# Altium project LED_EN_Kian_V2.PrjPcb
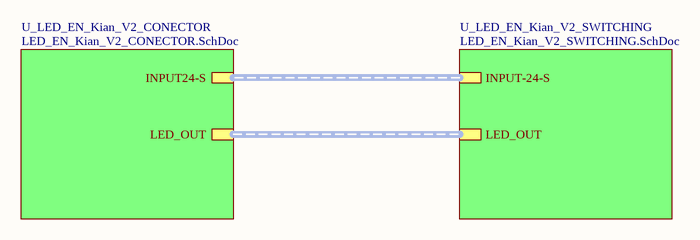
[diagram p0: LED_EN_Kian_V2_MANAGE.SchDoc]
3 sheets, 37 parts. Net scope: hierarchical (ports join the sheet entries above them; power ports are global).
Board file: LED_EN_Kian_V2_troid.PcbDoc
Sheets:
  LED_EN_Kian_V2_MANAGE.SchDoc
    U_LED_EN_Kian_V2_CONECTOR = LED_EN_Kian_V2_CONECTOR.SchDoc
    U_LED_EN_Kian_V2_SWITCHING = LED_EN_Kian_V2_SWITCHING.SchDoc

## Sheet LED_EN_Kian_V2_MANAGE.SchDoc
size A

### Sub-sheets
U_LED_EN_Kian_V2_CONECTOR = LED_EN_Kian_V2_CONECTOR.SchDoc: LED_OUT (harness LED_OUT), INPUT24-S (harness INPUT-24-S)
U_LED_EN_Kian_V2_SWITCHING = LED_EN_Kian_V2_SWITCHING.SchDoc: INPUT-24-S (harness INPUT-24-S), LED_OUT (harness LED_OUT)

### Buses and harness runs
harness sheet U_LED_EN_Kian_V2_CONECTOR/INPUT24-S = sheet U_LED_EN_Kian_V2_SWITCHING/INPUT-24-S
harness sheet U_LED_EN_Kian_V2_CONECTOR/LED_OUT = sheet U_LED_EN_Kian_V2_SWITCHING/LED_OUT

## Sheet LED_EN_Kian_V2_CONECTOR.SchDoc
size A
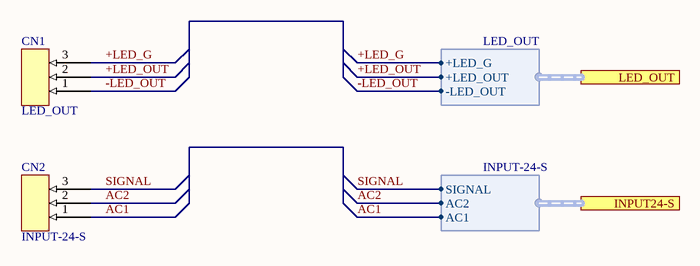
[diagram p1: LED_EN_Kian_V2_CONECTOR.SchDoc]

### Parts
CN1  LED_OUT  [CONECTOR/FONIX/3PIN]
CN2  INPUT-24-S  [CONECTOR/FONIX/3PIN]

### Ports
INPUT24-S (harness INPUT-24-S), LED_OUT (harness LED_OUT)

### Harnesses
LED_OUT: +LED_G, +LED_OUT, -LED_OUT
INPUT-24-S: SIGNAL, AC2, AC1

### Nets
+LED_G: CN1.3 ; port LED_OUT.+LED_G
+LED_OUT: CN1.2 ; port LED_OUT.+LED_OUT
-LED_OUT: CN1.1 ; port LED_OUT.-LED_OUT
AC1: CN2.1 ; port INPUT24-S.AC1
AC2: CN2.2 ; port INPUT24-S.AC2
SIGNAL: CN2.3 ; port INPUT24-S.SIGNAL

### Library data of the parts
CN1 CN2 = CONECTOR/FONIX/3PIN

## Sheet LED_EN_Kian_V2_SWITCHING.SchDoc
size 260 x 299 mm
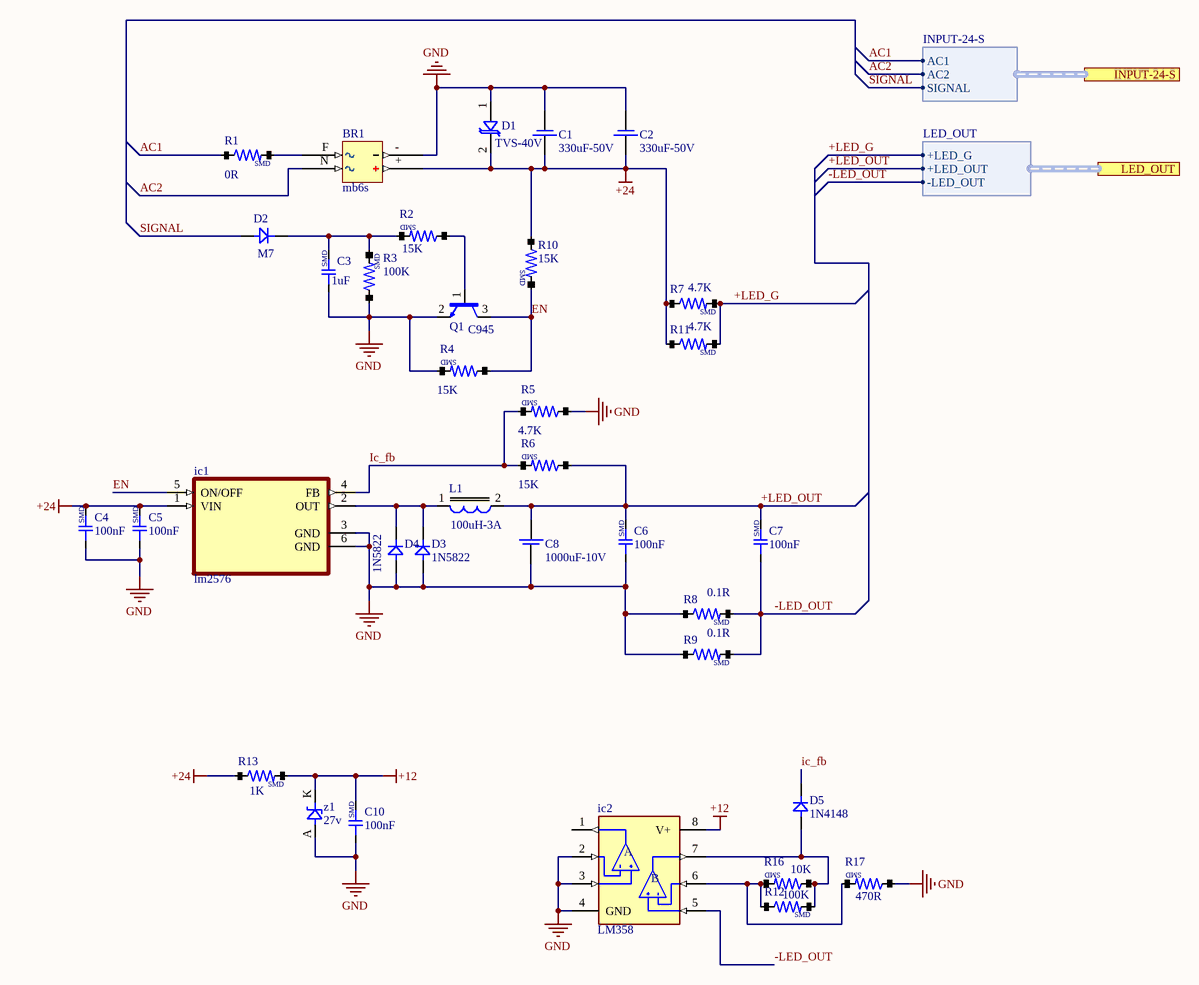
[diagram p2: LED_EN_Kian_V2_SWITCHING.SchDoc]

### Parts
BR1  mb6s  [MB6S/SMD]
C1  330uF-50V  [CAP-EL_P5MM]
C2  330uF-50V  [CAP-EL_P5MM]
C3  1uF  [CAP-0805]
C4  100nF  [CAP-0805]
C5  100nF  [CAP-0805]
C6  100nF  [CAP-0805]
C7  100nF  [CAP-0805]
C8  1000uF-10V  [CAP-EL-P3.5MM]
C10  100nF  [CAP-0805]
D1  TVS-40V  [TVS-5V-SMD]
D2  M7  [DIOD/1N4007/SMD]
D3  1N5822  [DIOD/1N4007/SMD]
D4  1N5822  [DIOD/1N4007/DIP]
D5  1N4148  [mini_melf]
ic1  lm2576  [lm2576]
ic2  LM358  [SOP-8]
L1  100uH-3A  [inductor-9*12]
Q1  C945  [SOT23]
R1  0R  [RES/1206]
R2  15K  [RES/0805]
R3  100K  [RES/0805]
R4  15K  [RES/0805]
R5  4.7K  [RES/0805]
R6  15K  [RES/0805]
R7  4.7K  [RES/1206]
R8  0.1R  [RES/1206]
R9  0.1R  [RES/1206]
R10  15K  [RES/0805]
R11  4.7K  [RES/1206]
R12  100K  [RES/0805]
R13  1K  [RES/1206]
R16  10K  [RES/0805]
R17  470R  [RES/0805]
z1  27v  [DIOD/RS1J]

### Ports
INPUT-24-S (harness INPUT-24-S), LED_OUT (harness LED_OUT)

### Harnesses
INPUT-24-S: AC1, AC2, SIGNAL
LED_OUT: +LED_G, +LED_OUT, -LED_OUT

### Nets
+12: C10.2 ic2.8(V+) R13.2 z1.K
+24: BR1.+ C1.+ C2.+ C4.2 C5.2 D1.2 ic1.1(VIN) R7.1 R10.1 R11.1 R13.1
GND: BR1.- C1.- C2.- C3.1 C4.1 C5.1 C6.1 C8.- C10.1 D1.1 D3.A D4.A ic1.3(GND) ic1.6(GND) ic2.2(-INA) ic2.3(+INA) ic2.4(GND) Q1.2(E) R3.1 R4.2 R5.1 R8.1 R9.1 R17.1 z1.A
+LED_G: R7.2 R11.2 ; port LED_OUT.+LED_G
+LED_OUT: C6.2 C7.2 C8.+ L1.2 R6.1 ; port LED_OUT.+LED_OUT
-LED_OUT: C7.1 ic2.5(+INB) R8.2 R9.2 ; port LED_OUT.-LED_OUT
AC1: R1.1 ; port INPUT-24-S.AC1
AC2: BR1.N ; port INPUT-24-S.AC2
EN: ic1.5(ON/OFF) Q1.3(C) R4.1 R10.2
Ic_fb: D5.K ic1.4(FB) R5.2 R6.2
SIGNAL: D2.A ; port INPUT-24-S.SIGNAL
NetBR1_F: BR1.F R1.2
NetC3_2: C3.2 D2.K R2.2 R3.2
NetD3_K: D3.K D4.K ic1.2(OUT) L1.1
NetD5_A: D5.A ic2.7(OUTB) R12.2 R16.1
Netic2_6: ic2.6(-INB) R12.1 R16.2 R17.2
NetQ1_1: Q1.1(B) R2.1

Not connected (* = marked no-connect by the designer): ic2 1(OUTA)

### Notes on the sheet
- (in symbol cap_smd) SMD
- (in symbol LM358) A; B
- (in symbol RES/SMD) SMD

### Library data of the parts
BR1 = BRIDGE RECTIFIERS/SMD
C1 C2 C8 = cap-electrolit
C3-C7 C10 = cap_smd
D1 = TVS-SMD
D2-D5 = DIOD/RECTIFIERS
L1 = inductor
Q1 = NPN
R1-R13 R16 R17 = RES/SMD
z1 = zener-0.5w

## Nets that join several sheets
+LED_G: LED_EN_Kian_V2_CONECTOR (CN1.3), LED_EN_Kian_V2_SWITCHING (R7.2 R11.2)
+LED_OUT: LED_EN_Kian_V2_CONECTOR (CN1.2), LED_EN_Kian_V2_SWITCHING (5 pins)
-LED_OUT: LED_EN_Kian_V2_CONECTOR (CN1.1), LED_EN_Kian_V2_SWITCHING (C7.1 ic2.5 R8.2 R9.2)
AC1: LED_EN_Kian_V2_CONECTOR (CN2.1), LED_EN_Kian_V2_SWITCHING (R1.1)
AC2: LED_EN_Kian_V2_CONECTOR (CN2.2), LED_EN_Kian_V2_SWITCHING (BR1.N)
SIGNAL: LED_EN_Kian_V2_CONECTOR (CN2.3), LED_EN_Kian_V2_SWITCHING (D2.A)